# Altium schematic sheet BLOCK8.SchDoc
size A3; SheetNumber: 8; SheetTotal: 12
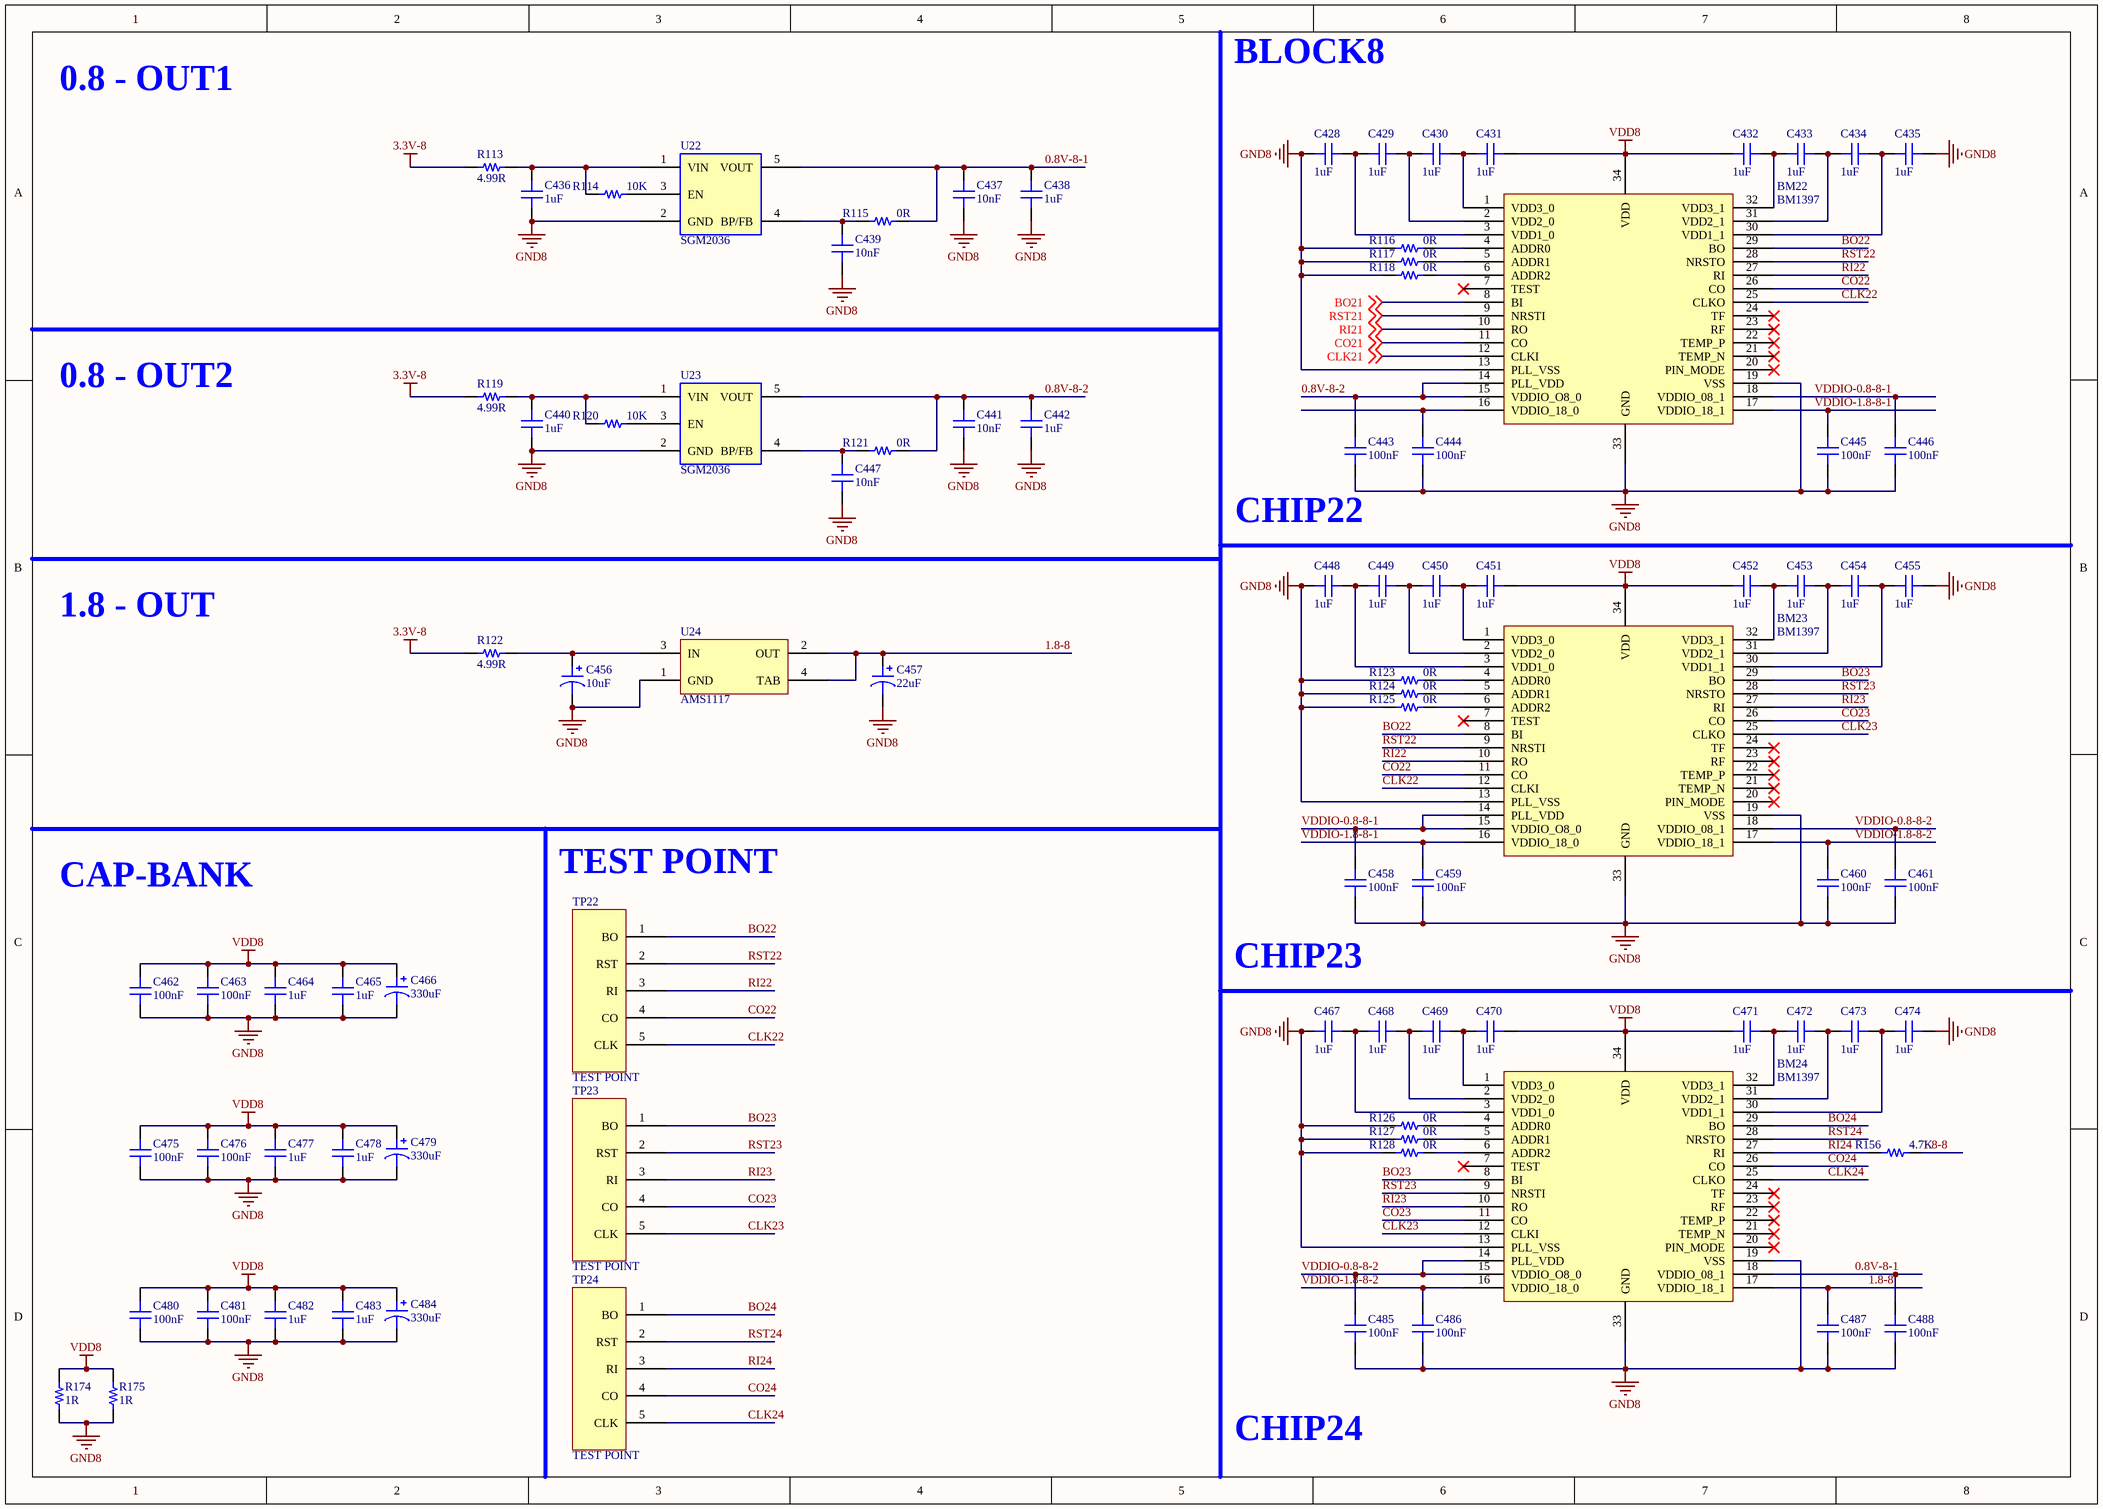
[diagram p0: BLOCK8.SchDoc]

## Parts
BM22  BM1397  [BM1387]
BM23  BM1397  [BM1387]
BM24  BM1397  [BM1387]
C428  1uF  [CAP-SMD-0603]
C429  1uF  [CAP-SMD-0603]
C430  1uF  [CAP-SMD-0603]
C431  1uF  [CAP-SMD-0603]
C432  1uF  [CAP-SMD-0603]
C433  1uF  [CAP-SMD-0603]
C434  1uF  [CAP-SMD-0603]
C435  1uF  [CAP-SMD-0603]
C436  1uF  [CAP_SMD_0805]
C437  10nF  [CAP_SMD_0805]
C438  1uF  [CAP_SMD_0805]
C439  10nF  [CAP_SMD_0805]
C440  1uF  [CAP_SMD_0805]
C441  10nF  [CAP_SMD_0805]
C442  1uF  [CAP_SMD_0805]
C443  100nF  [CAP_SMD_0805]
C444  100nF  [CAP_SMD_0805]
C445  100nF  [CAP_SMD_0805]
C446  100nF  [CAP_SMD_0805]
C447  10nF  [CAP_SMD_0805]
C448  1uF  [CAP-SMD-0603]
C449  1uF  [CAP-SMD-0603]
C450  1uF  [CAP-SMD-0603]
C451  1uF  [CAP-SMD-0603]
C452  1uF  [CAP-SMD-0603]
C453  1uF  [CAP-SMD-0603]
C454  1uF  [CAP-SMD-0603]
C455  1uF  [CAP-SMD-0603]
C456  10uF  [CAP-TAN-CASE-A]
C457  22uF  [CAP-TAN-CASE-A]
C458  100nF  [CAP_SMD_0805]
C459  100nF  [CAP_SMD_0805]
C460  100nF  [CAP_SMD_0805]
C461  100nF  [CAP_SMD_0805]
C462  100nF  [CAP_SMD_0805]
C463  100nF  [CAP_SMD_0805]
C464  1uF  [CAP_SMD_0805]
C465  1uF  [CAP_SMD_0805]
C466  330uF  [CAP-TAN-CASE-E]
C467  1uF  [CAP-SMD-0603]
C468  1uF  [CAP-SMD-0603]
C469  1uF  [CAP-SMD-0603]
C470  1uF  [CAP-SMD-0603]
C471  1uF  [CAP-SMD-0603]
C472  1uF  [CAP-SMD-0603]
C473  1uF  [CAP-SMD-0603]
C474  1uF  [CAP-SMD-0603]
C475  100nF  [CAP_SMD_0805]
C476  100nF  [CAP_SMD_0805]
C477  1uF  [CAP_SMD_0805]
C478  1uF  [CAP_SMD_0805]
C479  330uF  [CAP-TAN-CASE-E]
C480  100nF  [CAP_SMD_0805]
C481  100nF  [CAP_SMD_0805]
C482  1uF  [CAP_SMD_0805]
C483  1uF  [CAP_SMD_0805]
C484  330uF  [CAP-TAN-CASE-E]
C485  100nF  [CAP_SMD_0805]
C486  100nF  [CAP_SMD_0805]
C487  100nF  [CAP_SMD_0805]
C488  100nF  [CAP_SMD_0805]
R113  4.99R  [RES-SMD-1206]
R114  10K  [RES-SMD-0402]
R115  0R  [RES-SMD-0402]
R116  0R  [RES-SMD-0402]
R117  0R  [RES-SMD-0402]
R118  0R  [RES-SMD-0402]
R119  4.99R  [RES-SMD-1206]
R120  10K  [RES-SMD-0402]
R121  0R  [RES-SMD-0402]
R122  4.99R  [RES-SMD-1206]
R123  0R  [RES-SMD-0402]
R124  0R  [RES-SMD-0402]
R125  0R  [RES-SMD-0402]
R126  0R  [RES-SMD-0402]
R127  0R  [RES-SMD-0402]
R128  0R  [RES-SMD-0402]
R156  4.7K  [RES-SMD-0402]
R174  1R  [RES-SMD-1210]
R175  1R  [RES-SMD-1210]
TP22  TEST POINT  [TEST_POINT]
TP23  TEST POINT  [TEST_POINT]
TP24  TEST POINT  [TEST_POINT]
U22  SGM2036  [SOT23-5PIN]
U23  SGM2036  [SOT23-5PIN]
U24  AMS1117  [AMS1117]

## Nets
3.3V-8: R113.1 R119.1 R122.1
GND8: BM22.13(PLL_VSS) BM22.19(VSS) BM22.33(GND) BM23.13(PLL_VSS) BM23.19(VSS) BM23.33(GND) BM24.13(PLL_VSS) BM24.19(VSS) BM24.33(GND) C428.1 C435.2 C436.1 C437.1 C438.1 C439.1 C440.1 C441.1 C442.1 C443.1 C444.1 C445.1 C446.1 C447.1 C448.1 C455.2 C456.2 C457.2 C458.1 C459.1 C460.1 C461.1 C462.1 C463.1 C464.1 C465.1 C466.2 C467.1 C474.2 C475.1 C476.1 C477.1 C478.1 C479.2 C480.1 C481.1 C482.1 C483.1 C484.2 C485.1 C486.1 C487.1 C488.1 R116.1 R117.1 R118.1 R123.1 R124.1 R125.1 R126.1 R127.1 R128.1 R174.1 R175.1 U22.2(GND) U23.2(GND) U24.1(GND)
VDD8: BM22.34(VDD) BM23.34(VDD) BM24.34(VDD) C431.2 C432.1 C451.2 C452.1 C462.2 C463.2 C464.2 C465.2 C466.1 C470.2 C471.1 C475.2 C476.2 C477.2 C478.2 C479.1 C480.2 C481.2 C482.2 C483.2 C484.1 R174.2 R175.2
0.8V-8-1: BM24.18(VDDIO_08_1) C437.2 C438.2 C488.2 R115.2 U22.5(VOUT)
0.8V-8-2: BM22.14(PLL_VDD) BM22.15(VDDIO_O8_0) C441.2 C442.2 C443.2 R121.2 U23.5(VOUT)
1.8-8: BM24.17(VDDIO_18_1) C457.1 C487.2 R156.2 U24.2(OUT) U24.4(TAB)
BO21: BM22.8(BI) ; off-sheet BO21
BO22: BM22.29(BO) BM23.8(BI) TP22.1(BO)
BO23: BM23.29(BO) BM24.8(BI) TP23.1(BO)
BO24: BM24.29(BO) TP24.1(BO)
CLK21: BM22.12(CLKI) ; off-sheet CLK21
CLK22: BM22.25(CLKO) BM23.12(CLKI) TP22.5(CLK)
CLK23: BM23.25(CLKO) BM24.12(CLKI) TP23.5(CLK)
CLK24: BM24.25(CLKO) TP24.5(CLK)
CO21: BM22.11(CO) ; off-sheet CO21
CO22: BM22.26(CO) BM23.11(CO) TP22.4(CO)
CO23: BM23.26(CO) BM24.11(CO) TP23.4(CO)
CO24: BM24.26(CO) TP24.4(CO)
RI21: BM22.10(RO) ; off-sheet RI21
RI22: BM22.27(RI) BM23.10(RO) TP22.3(RI)
RI23: BM23.27(RI) BM24.10(RO) TP23.3(RI)
RI24: BM24.27(RI) R156.1 TP24.3(RI)
RST21: BM22.9(NRSTI) ; off-sheet RST21
RST22: BM22.28(NRSTO) BM23.9(NRSTI) TP22.2(RST)
RST23: BM23.28(NRSTO) BM24.9(NRSTI) TP23.2(RST)
RST24: BM24.28(NRSTO) TP24.2(RST)
VDDIO-0.8-8-1: BM22.18(VDDIO_08_1) BM23.14(PLL_VDD) BM23.15(VDDIO_O8_0) C446.2 C458.2
VDDIO-0.8-8-2: BM23.18(VDDIO_08_1) BM24.14(PLL_VDD) BM24.15(VDDIO_O8_0) C461.2 C485.2
VDDIO-1.8-8-1: BM22.17(VDDIO_18_1) BM23.16(VDDIO_18_0) C445.2 C459.2
VDDIO-1.8-8-2: BM23.17(VDDIO_18_1) BM24.16(VDDIO_18_0) C460.2 C486.2
NetBM22_1: BM22.1(VDD3_0) C430.2 C431.1
NetBM22_2: BM22.2(VDD2_0) C429.2 C430.1
NetBM22_3: BM22.3(VDD1_0) C428.2 C429.1
NetBM22_4: BM22.4(ADDR0) R116.2
NetBM22_5: BM22.5(ADDR1) R117.2
NetBM22_6: BM22.6(ADDR2) R118.2
NetBM22_16: BM22.16(VDDIO_18_0) C444.2
NetBM22_30: BM22.30(VDD1_1) C434.2 C435.1
NetBM22_31: BM22.31(VDD2_1) C433.2 C434.1
NetBM22_32: BM22.32(VDD3_1) C432.2 C433.1
NetBM23_1: BM23.1(VDD3_0) C450.2 C451.1
NetBM23_2: BM23.2(VDD2_0) C449.2 C450.1
NetBM23_3: BM23.3(VDD1_0) C448.2 C449.1
NetBM23_4: BM23.4(ADDR0) R123.2
NetBM23_5: BM23.5(ADDR1) R124.2
NetBM23_6: BM23.6(ADDR2) R125.2
NetBM23_30: BM23.30(VDD1_1) C454.2 C455.1
NetBM23_31: BM23.31(VDD2_1) C453.2 C454.1
NetBM23_32: BM23.32(VDD3_1) C452.2 C453.1
NetBM24_1: BM24.1(VDD3_0) C469.2 C470.1
NetBM24_2: BM24.2(VDD2_0) C468.2 C469.1
NetBM24_3: BM24.3(VDD1_0) C467.2 C468.1
NetBM24_4: BM24.4(ADDR0) R126.2
NetBM24_5: BM24.5(ADDR1) R127.2
NetBM24_6: BM24.6(ADDR2) R128.2
NetBM24_30: BM24.30(VDD1_1) C473.2 C474.1
NetBM24_31: BM24.31(VDD2_1) C472.2 C473.1
NetBM24_32: BM24.32(VDD3_1) C471.2 C472.1
NetC436_2: C436.2 R113.2 R114.1 U22.1(VIN)
NetC439_2: C439.2 R115.1 U22.4(BP/FB)
NetC440_2: C440.2 R119.2 R120.1 U23.1(VIN)
NetC447_2: C447.2 R121.1 U23.4(BP/FB)
NetC456_1: C456.1 R122.2 U24.3(IN)
NetR114_2: R114.2 U22.3(EN)
NetR120_2: R120.2 U23.3(EN)

Not connected (* = marked no-connect by the designer): BM22 7(TEST)* 20(PIN_MODE)* 21(TEMP_N)* 22(TEMP_P)* 23(RF)* 24(TF)*; BM23 7(TEST)* 20(PIN_MODE)* 21(TEMP_N)* 22(TEMP_P)* 23(RF)* 24(TF)*; BM24 7(TEST)* 20(PIN_MODE)* 21(TEMP_N)* 22(TEMP_P)* 23(RF)* 24(TF)*

## Notes on the sheet
- 0.8 - OUT1
- BLOCK8
- 0.8 - OUT2
- (near C443) CHIP22
- 1.8 - OUT
- CAP-BANK
- TEST POINT
- CHIP23
- CHIP24

## Library data of the parts
BM22-BM24 = BM1397_1
C428-C455 C458-C465 C467-C478 C480-C483 C485-C488 = CAP
C456 C457 C466 C479 C484 = POLARIZED CAP
R113-R128 R156 R174 R175 = RES